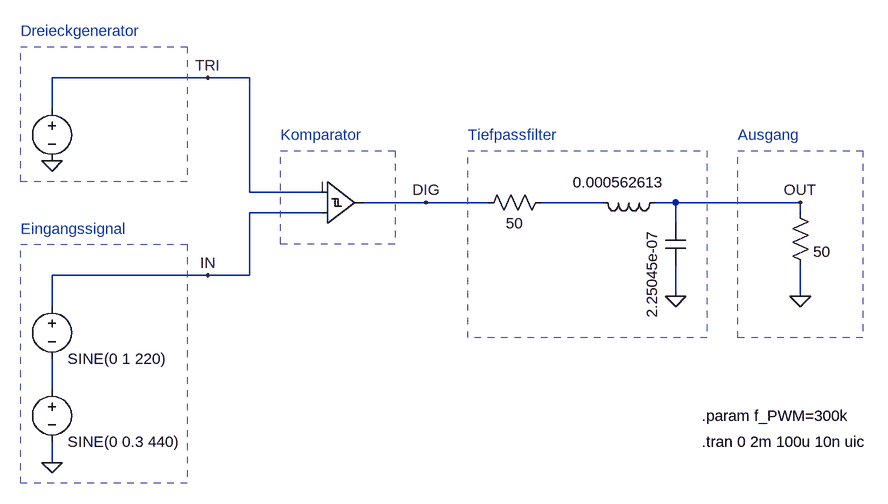
[diagram p0: schematic class_D_principe.asc]
class_D_principe.asc, the LTspice schematic file:
Version 4
SHEET 1 2376 996
WIRE 512 64 272 64
WIRE 576 64 512 64
WIRE 272 112 272 64
WIRE 576 240 576 64
WIRE 688 240 576 240
WIRE 848 256 752 256
WIRE 944 256 848 256
WIRE 1120 256 1024 256
WIRE 1232 256 1200 256
WIRE 1424 256 1232 256
WIRE 688 272 576 272
WIRE 1424 272 1424 256
WIRE 1232 288 1232 256
WIRE 512 368 272 368
WIRE 576 368 576 272
WIRE 576 368 512 368
WIRE 1232 400 1232 352
WIRE 1424 400 1424 352
WIRE 272 416 272 368
WIRE 272 544 272 496
WIRE 272 656 272 624
FLAG 272 192 0
FLAG 512 64 TRI
FLAG 272 656 0
FLAG 512 368 IN
FLAG 848 256 DIG
FLAG 1424 400 0
FLAG 1424 256 OUT
FLAG 1232 400 0
SYMBOL voltage 272 96 R0
WINDOW 3 24 96 Invisible 2
WINDOW 0 24 16 Invisible 2
SYMATTR Value PULSE(-1 1 0 {1/(2*f_PWM)} {1/(2*f_PWM)} 0 {1.0/f_PWM})
SYMATTR InstName V1
SYMBOL res 1408 256 R0
WINDOW 0 36 40 Invisible 2
SYMATTR InstName R2
SYMATTR Value 50
SYMBOL Digital\\diffschmtbuf 688 320 M180
WINDOW 0 51 87 Invisible 2
WINDOW 3 40 35 Invisible 2
SYMATTR InstName A1
SYMATTR Value Vhigh=1, Vlow=-1, Vt=0, Vh=0, Rout=1m
SYMBOL voltage 272 400 R0
WINDOW 0 24 16 Invisible 2
WINDOW 123 0 0 Left 2
WINDOW 39 0 0 Left 2
SYMATTR InstName V5
SYMATTR Value SINE(0 1 220)
SYMBOL voltage 272 528 R0
WINDOW 0 24 16 Invisible 2
WINDOW 123 0 0 Left 2
WINDOW 39 0 0 Left 2
SYMATTR InstName V2
SYMATTR Value SINE(0 0.3 440)
SYMBOL res 1040 240 R90
WINDOW 0 0 56 Invisible 2
WINDOW 3 32 56 VTop 2
SYMATTR InstName R3
SYMATTR Value 50
SYMBOL ind 1216 240 R90
WINDOW 0 5 56 Invisible 2
WINDOW 3 -31 71 VTop 2
SYMATTR InstName L4
SYMATTR Value 0.000562613
SYMBOL cap 1216 288 R0
WINDOW 0 24 8 Invisible 2
WINDOW 3 -20 9 VRight 2
SYMATTR InstName C4
SYMATTR Value 2.25045e-07
TEXT 1272 624 Left 2 !.tran 0 2m 100u 10n uic
TEXT 1272 584 Left 2 !.param f_PWM=300k
TEXT 224 -8 Left 2 ;Dreieckgenerator
TEXT 224 296 Left 2 ;Eingangssignal
TEXT 624 152 Left 2 ;Komparator
TEXT 1328 152 Left 2 ;Ausgang
TEXT 912 152 Left 2 ;Tiefpassfilter
RECTANGLE Normal 800 320 624 176 2
RECTANGLE Normal 480 688 224 320 2
RECTANGLE Normal 1520 464 1328 176 2
RECTANGLE Normal 480 224 224 16 2
RECTANGLE Normal 1280 464 912 176 2

The netlist it stands for:
* class_D_principe.asc
V1 TRI 0 PULSE(-1 1 0 {1/(2*f_PWM)} {1/(2*f_PWM)} 0 {1.0/f_PWM})
R2 OUT 0 50
A1 IN TRI 0 0 0 0 DIG 0 SCHMITT Vhigh=1, Vlow=-1, Vt=0, Vh=0, Rout=1m
V5 IN N002 SINE(0 1 220)
V2 N002 0 SINE(0 0.3 440)
R3 N001 DIG 50
L4 OUT N001 0.000562613
C4 OUT 0 2.25045e-07
.tran 0 2m 100u 10n uic
.param f_PWM=300k
* Dreieckgenerator
* Eingangssignal
* Komparator
* Ausgang
* Tiefpassfilter
.backanno
.end

* Results of the author's LTspice run, read from the files saved beside the schematic
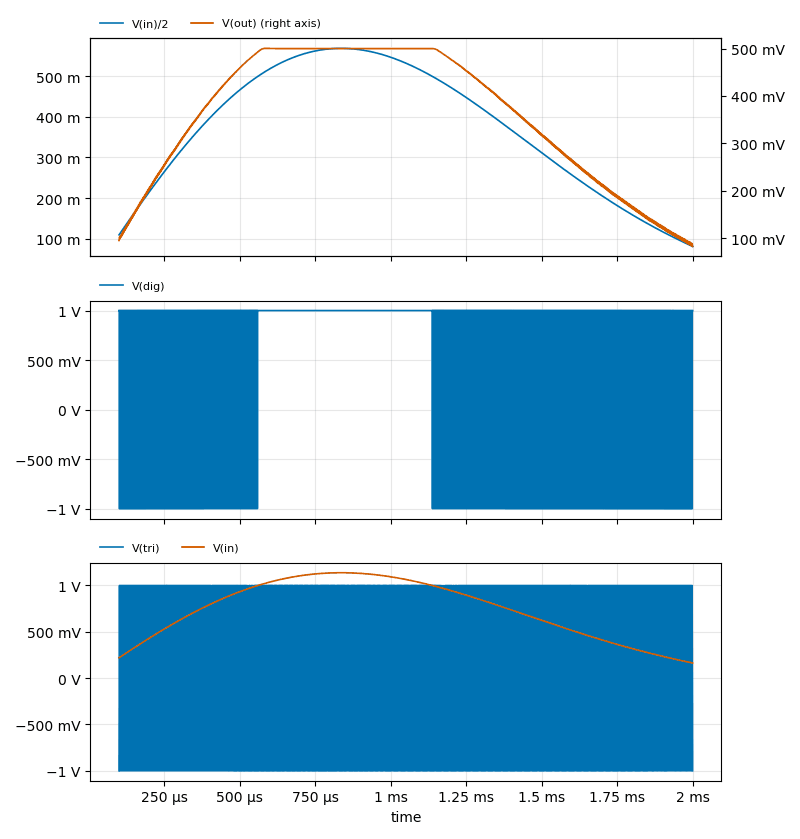
[diagram p1: Transient Analysis of class_D_principe.asc, plotted from the saved traces]
* Transient Analysis, 1 run:
*   V(in)/2: min 81.38 m, max 568.2 m, average 372.2 m, rms 403.1 m, last 81.38 m
*   V(out): min 82.51 mV, max 500.4 mV, average 358.7 mV, rms 384.8 mV, last 82.51 mV
*   V(dig): min -1 V, max 1 V, average 717.1 mV, rms 996.9 mV, last 1 V
*   V(tri): min -1 V, max 1 V, average 11.24 µV, rms 712.3 mV, last -1 V
*   V(in): min 162.8 mV, max 1.136 V, average 744.4 mV, rms 806.1 mV, last 162.8 mV